# Altium schematic sheet RTL-SDR.SchDoc
size A3; SheetNumber: 2; SheetTotal: 3; SPICEModelCacheDOKHCWCC: <root> / <DocumentId>DOKHCWCC</DocumentId> / <CacheFrame Number="0"> / <Model Name="0402_782423100_10ohm" Kind="CKT"> / <Text>******* / .subckt 0402_782423100_10ohm 1 2 / Rp 1 2 14 / Cp 1 2 0.057p / Rs 1 N3 0.03 / L1 N3 2 0.0232u / .ends 0402_782423100_10ohm</Text> / </Model> / </CacheFrame> / </root>
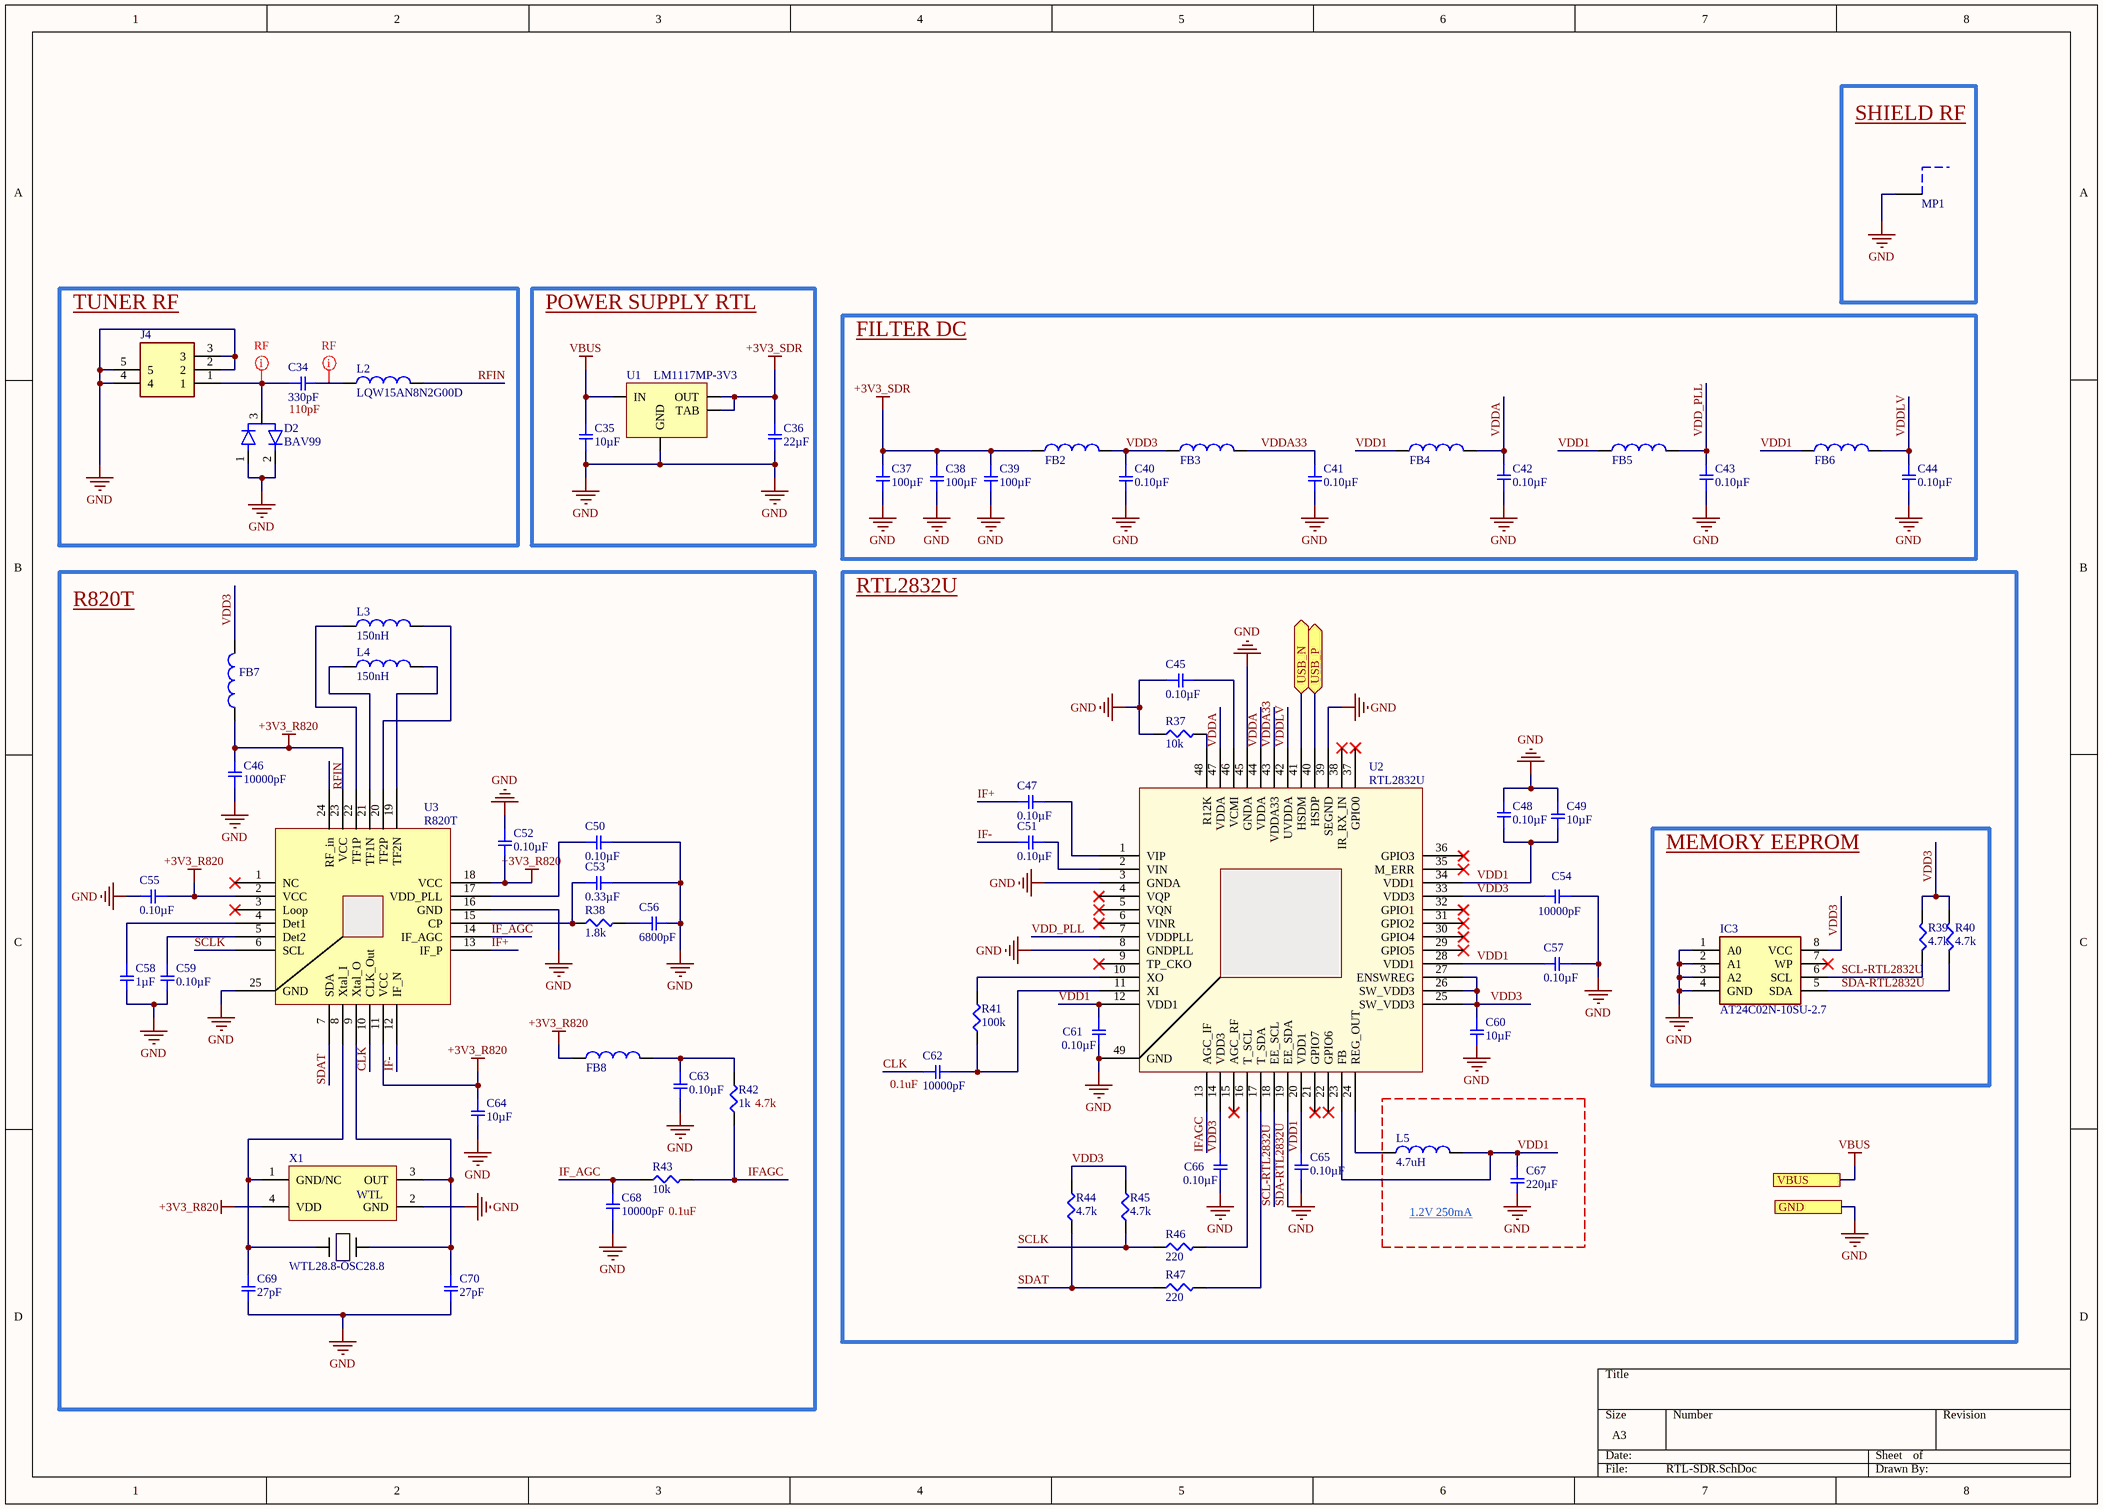
[diagram p0: RTL-SDR.SchDoc]

## Parts
C34  330pF  [SMD-0402C]
C35  10µF  [SMD-0805C]
C36  22µF  [SMD-0805C]
C37  100µF  [SMD-1210C]
C38  100µF  [SMD-1210C]
C39  100µF  [SMD-1210C]
C40  0.10µF  [SMD-0402C]
C41  0.10µF  [SMD-0402C]
C42  0.10µF  [SMD-0402C]
C43  0.10µF  [SMD-0402C]
C44  0.10µF  [SMD-0402C]
C45  0.10µF  [SMD-0402C]
C46  10000pF  [SMD-0402C]
C47  0.10µF  [SMD-0402C]
C48  0.10µF  [SMD-0402C]
C49  10µF  [SMD-0603C]
C50  0.10µF  [SMD-0402C]
C51  0.10µF  [SMD-0402C]
C52  0.10µF  [SMD-0402C]
C53  0.33µF  [SMD-0402C]
C54  10000pF  [SMD-0402C]
C55  0.10µF  [SMD-0402C]
C56  6800pF  [SMD-0402C]
C57  0.10µF  [SMD-0402C]
C58  1µF  [SMD-0402C]
C59  0.10µF  [SMD-0402C]
C60  10µF  [SMD-0603C]
C61  0.10µF  [SMD-0402C]
C62  10000pF  [SMD-0402C]
C63  0.10µF  [SMD-0402C]
C64  10µF  [SMD-0805C]
C65  0.10µF  [SMD-0402C]
C66  0.10µF  [SMD-0402C]
C67  220µF  [SMD-1210C]
C68  10000pF  [SMD-0402C]
C69  27pF  [SMD-0402C]
C70  27pF  [SMD-0402C]
D2  BAV99  [DIO_BAV99]
FB2  10Ohm  [WE-CBA_0402_L1W0.5H0.5_HC]  (value not drawn)
FB3  10Ohm  [WE-CBA_0402_L1W0.5H0.5_HC]  (value not drawn)
FB4  10Ohm  [WE-CBA_0402_L1W0.5H0.5_HC]  (value not drawn)
FB5  10Ohm  [WE-CBA_0402_L1W0.5H0.5_HC]  (value not drawn)
FB6  10Ohm  [WE-CBA_0402_L1W0.5H0.5_HC]  (value not drawn)
FB7  10Ohm  [WE-CBA_0402_L1W0.5H0.5_HC]  (value not drawn)
FB8  10Ohm  [WE-CBA_0402_L1W0.5H0.5_HC]  (value not drawn)
IC3  AT24C02N-10SU-2.7  [SOIC127P600X175-8N]
J4  SMA-J-P-H-RA-TH1  [SMAJPHRATH1]  (value not drawn)
L2  LQW15AN8N2G00D  [INDC1006X60N]
L3  150nH  [INDC1608X100N]
L4  150nH  [INDC1608X100N]
L5  4.7uH  [INDC2518X200N]
MP1  36903205S  [36903205S]  (value not drawn)
R37  10k  [SMD-0402-RES]
R38  1.8k  [SMD-0402-RES]
R39  4.7k  [SMD-0402-RES]
R40  4.7k  [SMD-0402-RES]
R41  100k  [SMD-0402-RES]
R42  1k  [SMD-0402-RES]
R43  10k  [SMD-0402-RES]
R44  4.7k  [SMD-0402-RES]
R45  4.7k  [SMD-0402-RES]
R46  220  [SMD-0402-RES]
R47  220  [SMD-0402-RES]
U1  LM1117MP-3V3  [SOT223]
U2  RTL2832U  [QFN40P600X600X84_HS-49N]
U3  R820T  [QFN50P400X400X85_HS-25N_r820t]
X1  WTL28.8-OSC28.8  [WTL28.8-OSC28.8]

## Blocks framed on the sheet
SHIELD RF: MP1
TUNER RF: C34 D2 J4 L2
POWER SUPPLY RTL: C35 C36 U1
FILTER DC: C37-C44 FB2-FB6
R820T: C46 C50 C52 C53 C55 C56 C58 C59 C63 C64 C68-C70 FB7 FB8 L3 L4 R38 R42 R43 U3 X1
RTL2832U: C45 C47-C49 C51 C54 C57 C60-C62 C65 C66 R37 R41 R44-R47 U2
MEMORY EEPROM: IC3 R39 R40
1.2V 250mA: C67 L5

## Ports
GND (see DSD_Aerobits_RPI4_OLED[1A], HUB-USB[6C]), USB_N (bidir, see DSD_Aerobits_RPI4_OLED[1A]), USB_P (bidir, see DSD_Aerobits_RPI4_OLED[1A]), VBUS (see DSD_Aerobits_RPI4_OLED[1A])

## Nets
+3V3_R820: C46.2 C52.2 C55.1 C64.1 FB7.1 FB8.1 U3.2(VCC) U3.11(VCC) U3.18(VCC) U3.23(VCC) X1.4(VDD)
+3V3_SDR: C36.2 C37.1 C38.1 C39.1 FB2.1 U1.2(OUT) U1.4(TAB)
GND: C35.1 C36.1 C37.2 C38.2 C39.2 C40.2 C41.2 C42.1 C43.1 C44.1 C45.1 C46.1 C48.2 C49.1 C50.1 C52.1 C53.1 C54.1 C55.2 C56.2 C57.1 C58.2 C59.2 C60.2 C61.2 C63.2 C64.2 C65.2 C66.2 C67.2 C68.1 C69.2 C70.2 D2.1 D2.2 IC3.1(A0) IC3.2(A1) IC3.3(A2) IC3.4(GND) J4.2 J4.3 J4.4 J4.5 MP1.1 R37.1 U1.1(GND) U2.3(GNDA) U2.8(GNDPLL) U2.39(SEGND) U2.45(GNDA) U2.49(GND) U3.16(GND) U3.25(GND) X1.2(GND) ; port GND
VBUS: C35.2 U1.3(IN) ; port VBUS
CLK: C62.1 U3.10(CLK_Out)
IF+: C47.2 U3.13(IF_P)
IF-: C51.2 U3.12(IF_N)
IF_AGC: C68.2 R43.1 U3.14(IF_AGC)
IFAGC: R42.1 R43.2 U2.13(AGC_IF)
RFIN: L2.2 U3.24(RF_in)
SCL-RTL2832U: IC3.6(SCL) R39.1 U2.18(EE_SCL)
SCLK: R45.1 R46.1 U3.6(SCL)
SDA-RTL2832U: IC3.5(SDA) R40.1 U2.19(EE_SDA)
SDAT: R44.1 R47.1 U3.7(SDA)
USB_N: U2.41(HSDM) ; port USB_N
USB_P: U2.40(HSDP) ; port USB_P
VDD1: C48.1 C49.2 C57.2 C61.1 C65.1 C67.1 FB4.1 FB5.1 FB6.1 L5.2 U2.12(VDD1) U2.20(VDD1) U2.23(FB) U2.28(VDD1) U2.34(VDD1)
VDD3: C40.1 C54.2 C60.1 C66.1 FB2.2 FB3.1 FB7.2 IC3.8(VCC) R39.2 R40.2 R44.2 R45.2 U2.14(VDD3) U2.25(SW_VDD3) U2.26(SW_VDD3) U2.27(ENSWREG) U2.33(VDD3)
VDD_PLL: C43.2 FB5.2 U2.7(VDDPLL)
VDDA: C42.2 FB4.2 U2.44(VDDA) U2.47(VDDA)
VDDA33: C41.1 FB3.2 U2.43(VDDA33)
VDDLV: C44.2 FB6.2 U2.42(UVDDA)
NetC34_1: C34.1 D2.3 J4.1
NetC34_2: C34.2 L2.1
NetC45_2: C45.2 U2.46(VCMI)
NetC47_1: C47.1 U2.1(VIP)
NetC50_2: C50.2 U3.17(VDD_PLL)
NetC51_1: C51.1 U2.2(VIN)
NetC53_2: C53.2 R38.1 U3.15(CP)
NetC56_1: C56.1 R38.2
NetC58_1: C58.1 U3.4(Det1)
NetC59_1: C59.1 U3.5(Det2)
NetC62_2: C62.2 R41.1 U2.11(XI)
NetC63_1: C63.1 FB8.2 R42.2
NetC69_1: C69.1 U3.8(Xtal_I) X1.1(GND/NC) X1.5
NetC70_1: C70.1 U3.9(Xtal_O) X1.3(OUT) X1.6
NetL3_1: L3.1 U3.22(TF1P)
NetL3_2: L3.2 U3.20(TF2P)
NetL4_1: L4.1 U3.21(TF1N)
NetL4_2: L4.2 U3.19(TF2N)
NetL5_1: L5.1 U2.24(REG_OUT)
NetR37_2: R37.2 U2.48(R12K)
NetR41_2: R41.2 U2.10(XO)
NetR46_2: R46.2 U2.16(T_SCL)
NetR47_2: R47.2 U2.17(T_SDA)

Not connected (* = marked no-connect by the designer): IC3 7(WP)*; U2 4(VQP)* 5(VQN)* 6(VINR)* 9(TP_CKO)* 15(AGC_RF)* 21(GPIO7)* 22(GPIO6)* 29(GPIO5)* 30(GPIO4)* 31(GPIO2)* 32(GPIO1)* 35(M_ERR)* 36(GPIO3)* 37(GPIO0)* 38(IR_RX_IN)*; U3 1(NC)* 3(Loop)*

## Layout directives
net class RF: NetC34_1, NetC34_2

## Notes on the sheet
- 110pF
- (near R42) 4.7k
- (near C62) 0.1uF
- (near R43) 0.1uF
- (in symbol WTL28.8-OSC28.8) WTL

## Library data of the parts
C34 = GRM1555C1E331JA01D: CAP CER 330PF 25V NP0 0402; Manufacturer: Murata Electronics North America; Factory Stock: 0; Unit Price (USD): 0,1; Minimum Quantity: 1; Tolerance: ±5%; Temperature Coefficient: C0G, NP0; Part Number: GRM1555C1E331JA01D; Datasheets: http://www.murata.com/~/media/webrenewal/support/library/catalog/products/capacitor/mlcc/c02e.pdf; Image: //media.digikey.com/Renders/Murata%20Renders/ZRB-SERIES-0402.jpg; Digi-Key Part Number: 490-8176-1-ND; Quantity Available: 41182; @ qty: 0; Packaging: Cut Tape (CT); Series: GRM; Part Status: Active; Value: 330pF; Voltage: 25V; Operating Temperature: -55°C ~ 125°C; Features: -; Ratings: -; Applications: General Purpose; Mounting Type: Surface Mount, MLCC; Package / Case: 0402 (1005 Metric); Size / Dimension: 0.039" L x 0.020" W (1.00mm x 0.50mm); Height - Seated (Max): -; Thickness (Max): 0.022" (0.55mm); Lead Spacing: -; Lead Style: -
C35 C64 = GRT21BC81C106KE01L: CAP CER 10UF 16V X6S 0805; Manufacturer: Murata Electronics North America; Factory Stock: 0; Unit Price (USD): 0,54; Minimum Quantity: 1; Tolerance: ±10%; Part Number: GRT21BC81C106KE01L; Datasheets: http://search.murata.co.jp/Ceramy/image/img/A01X/G101/ENG/GRT21BC81C106KE01-01.pdf; Image: //media.digikey.com/Renders/Murata%20Renders/GRT%20Series%200805(2012%20Metric).jpg; Digi-Key Part Number: 490-12343-1-ND; Quantity Available: 4300; @ qty: 0; Packaging: Cut Tape (CT); Series: GRT; Part Status: Active; Value: 10µF; Voltage: 16V; Temperature Coefficient: X6S; Operating Temperature: -55°C ~ 105°C; Features: Derating Recommended; Ratings: AEC-Q200; Applications: Automotive; Mounting Type: Surface Mount, MLCC; Package / Case: 0805 (2012 Metric); Size / Dimension: 0.079" L x 0.049" W (2.00mm x 1.25mm); Height - Seated (Max): -; Thickness (Max): 0.057" (1.45mm); Lead Spacing: -; Lead Style: -
C36 = GRT21BR61C226ME13L: CAP CER 22UF 16V X5R 0805; Manufacturer: Murata Electronics North America; Factory Stock: 0; Unit Price (USD): 0,58; Minimum Quantity: 1; Tolerance: ±20%; Part Number: GRT21BR61C226ME13L; Datasheets: http://search.murata.co.jp/Ceramy/image/img/A01X/G101/ENG/GRT21BR61C226ME13-01.pdf; Image: //media.digikey.com/Renders/Murata%20Renders/GRT%20Series%200805(2012%20Metric).jpg; Digi-Key Part Number: 490-12383-1-ND; Quantity Available: 32; @ qty: 0; Packaging: Cut Tape (CT); Series: GRT; Part Status: Active; Value: 22µF; Voltage: 16V; Temperature Coefficient: X5R; Operating Temperature: -55°C ~ 85°C; Features: -; Ratings: AEC-Q200; Applications: Automotive; Mounting Type: Surface Mount, MLCC; Package / Case: 0805 (2012 Metric); Size / Dimension: 0.079" L x 0.049" W (2.00mm x 1.25mm); Height - Seated (Max): -; Thickness (Max): 0.057" (1.45mm); Lead Spacing: -; Lead Style: -
C37-C39 = GRM32EC70J107ME15L: CAP CER 100UF 6.3V X7S 1210; Manufacturer: Murata Electronics North America; Factory Stock: 0; Unit Price (USD): 0,89; Minimum Quantity: 1; Tolerance: ±20%; Part Number: GRM32EC70J107ME15L; Datasheets: http://www.murata.com/~/media/webrenewal/support/library/catalog/products/capacitor/mlcc/c02e.pdf; Image: //media.digikey.com/Renders/Murata%20Renders/1210-32E.jpg; Digi-Key Part Number: 490-10530-1-ND; Quantity Available: 64; @ qty: 0; Packaging: Cut Tape (CT); Series: GRM; Part Status: Active; Value: 100µF; Voltage: 6.3V; Temperature Coefficient: X7S; Operating Temperature: -55°C ~ 125°C; Features: Derating Recommended; Ratings: -; Applications: General Purpose; Failure Rate: Surface Mount, MLCC; Mounting Type: 1210 (3225 Metric); Package / Case: 0.126" L x 0.098" W (3.20mm x 2.50mm); Size / Dimension: -; Height - Seated (Max): 0.106" (2.70mm); Thickness (Max): -; Lead Spacing: -
C40-C45 C47 C48 C50-C52 C55 C57 C59 C61 C63 C65 C66 = GCM155R71C104KA55J: CAP CER 0.1UF 16V X7R 0402; Manufacturer: Murata Electronics North America; Factory Stock: 0; Unit Price (USD): 0,1; Minimum Quantity: 1; Tolerance: ±10%; Part Number: GCM155R71C104KA55J; Datasheets: http://www.murata.com/~/media/webrenewal/support/library/catalog/products/capacitor/mlcc/c03e.ashx; Image: //media.digikey.com/Renders/Murata%20Renders/ZRB-SERIES-0402.jpg; Digi-Key Part Number: 490-7998-1-ND; Quantity Available: 618705; @ qty: 0; Packaging: Cut Tape (CT); Series: GCM; Part Status: Active; Value: 0.10µF; Voltage: 16V; Temperature Coefficient: X7R; Operating Temperature: -55°C ~ 125°C; Features: -; Ratings: AEC-Q200; Applications: Automotive; Mounting Type: Surface Mount, MLCC; Package / Case: 0402 (1005 Metric); Size / Dimension: 0.039" L x 0.020" W (1.00mm x 0.50mm); Height - Seated (Max): -; Thickness (Max): 0.022" (0.55mm); Lead Spacing: -; Lead Style: -
C46 C54 C68 = GRM155R71C103KA01J: CAP CER 10000PF 16V X7R 0402; Manufacturer: Murata Electronics North America; Factory Stock: 0; Unit Price (USD): 0,1; Minimum Quantity: 1; Tolerance: ±10%; Part Number: GRM155R71C103KA01J; Datasheets: http://www.murata.com/~/media/webrenewal/support/library/catalog/products/capacitor/mlcc/c02e.pdf; Image: //media.digikey.com/Renders/Murata%20Renders/ZRB-SERIES-0402.jpg; Digi-Key Part Number: 490-6326-1-ND; Quantity Available: 58230; @ qty: 0; Packaging: Cut Tape (CT); Series: GRM; Part Status: Active; Value: 10000pF; Voltage: 16V; Temperature Coefficient: X7R; Operating Temperature: -55°C ~ 125°C; Features: -; Ratings: -; Applications: General Purpose; Mounting Type: Surface Mount, MLCC; Package / Case: 0402 (1005 Metric); Size / Dimension: 0.039" L x 0.020" W (1.00mm x 0.50mm); Height - Seated (Max): -; Thickness (Max): 0.022" (0.55mm); Lead Spacing: -
C49 C60 = GRT188C81C106ME13D: CAP CER 10UF 16V X6S 0603; Manufacturer: Murata Electronics North America; Factory Stock: 0; Unit Price (USD): 0,46; Minimum Quantity: 1; Tolerance: ±20%; Part Number: GRT188C81C106ME13D; Datasheets: http://search.murata.co.jp/Ceramy/image/img/A01X/G101/ENG/GRT188C81C106ME13-01.pdf; Image: //media.digikey.com/Renders/Murata%20Renders/0603%28LQG18%29.jpg; Digi-Key Part Number: 490-12286-1-ND; Quantity Available: 5439; @ qty: 0; Packaging: Cut Tape (CT); Series: GRT; Part Status: Active; Value: 10µF; Voltage: 16V; Temperature Coefficient: X6S; Operating Temperature: -55°C ~ 105°C; Features: -; Ratings: AEC-Q200; Applications: Automotive; Mounting Type: Surface Mount, MLCC; Package / Case: 0603 (1608 Metric); Size / Dimension: 0.063" L x 0.031" W (1.60mm x 0.80mm); Height - Seated (Max): -; Thickness (Max): 0.035" (0.90mm); Lead Spacing: -; Lead Style: -
C53 = GRM155R61A334KE15D: CAP CER 0.33UF 10V X5R 0402; Manufacturer: Murata Electronics North America; Factory Stock: 0; Unit Price (USD): 0,17; Minimum Quantity: 1; Tolerance: ±10%; Part Number: GRM155R61A334KE15D; Datasheets: http://www.murata.com/~/media/webrenewal/support/library/catalog/products/capacitor/mlcc/c02e.pdf; Image: //media.digikey.com/Renders/Murata%20Renders/ZRB-SERIES-0402.jpg; Digi-Key Part Number: 490-3263-1-ND; Quantity Available: 378661; @ qty: 0; Packaging: Cut Tape (CT); Series: GRM; Part Status: Active; Value: 0.33µF; Voltage: 10V; Temperature Coefficient: X5R; Operating Temperature: -55°C ~ 85°C; Features: -; Ratings: -; Applications: General Purpose; Mounting Type: Surface Mount, MLCC; Package / Case: 0402 (1005 Metric); Size / Dimension: 0.039" L x 0.020" W (1.00mm x 0.50mm); Height - Seated (Max): -; Thickness (Max): 0.022" (0.55mm); Lead Spacing: -; Lead Style: -
C56 = GRM155R71E682KA01D: CAP CER 6800PF 25V X7R 0402; Manufacturer: Murata Electronics North America; Factory Stock: 0; Unit Price (USD): 0,1; Minimum Quantity: 1; Tolerance: ±10%; Part Number: GRM155R71E682KA01D; Datasheets: http://www.murata.com/~/media/webrenewal/support/library/catalog/products/capacitor/mlcc/c02e.pdf; Image: //media.digikey.com/Renders/Murata%20Renders/ZRB-SERIES-0402.jpg; Digi-Key Part Number: 490-1310-1-ND; Quantity Available: 242387; @ qty: 0; Packaging: Cut Tape (CT); Series: GRM; Part Status: Active; Value: 6800pF; Voltage: 25V; Temperature Coefficient: X7R; Operating Temperature: -55°C ~ 125°C; Features: -; Ratings: -; Applications: General Purpose; Mounting Type: Surface Mount, MLCC; Package / Case: 0402 (1005 Metric); Size / Dimension: 0.039" L x 0.020" W (1.00mm x 0.50mm); Height - Seated (Max): -; Thickness (Max): 0.022" (0.55mm); Lead Spacing: -; Lead Style: -
C58 = GRM155R61E105MA12D: CAP CER 1UF 25V X5R 0402; Manufacturer: Murata Electronics North America; Factory Stock: 0; Unit Price (USD): 0,1; Minimum Quantity: 1; Tolerance: ±20%; Part Number: GRM155R61E105MA12D; Datasheets: http://www.murata.com/~/media/webrenewal/support/library/catalog/products/capacitor/mlcc/c02e.pdf; Image: //media.digikey.com/Renders/Murata%20Renders/ZRB-SERIES-0402.jpg; Digi-Key Part Number: 490-10018-1-ND; Quantity Available: 32609; @ qty: 0; Packaging: Cut Tape (CT); Series: GRM; Part Status: Active; Value: 1µF; Voltage: 25V; Temperature Coefficient: X5R; Operating Temperature: -55°C ~ 85°C; Features: Derating Recommended; Ratings: -; Applications: General Purpose; Mounting Type: Surface Mount, MLCC; Package / Case: 0402 (1005 Metric); Size / Dimension: 0.039" L x 0.020" W (1.00mm x 0.50mm); Height - Seated (Max): -; Thickness (Max): 0.022" (0.55mm); Lead Spacing: -; Lead Style: -
C62 = GRM155R71C103KA01D: CAP CER 10000PF 16V X7R 0402; Manufacturer: Murata Electronics North America; Factory Stock: 0; Unit Price (USD): 0,1; Minimum Quantity: 1; Tolerance: ±10%; Part Number: GRM155R71C103KA01D; Datasheets: http://www.murata.com/~/media/webrenewal/support/library/catalog/products/capacitor/mlcc/c02e.pdf; Image: //media.digikey.com/Renders/Murata%20Renders/ZRB-SERIES-0402.jpg; Digi-Key Part Number: 490-1313-1-ND; Quantity Available: 3056688; @ qty: 0; Packaging: Cut Tape (CT); Series: GRM; Part Status: Active; Value: 10000pF; Voltage: 16V; Temperature Coefficient: X7R; Operating Temperature: -55°C ~ 125°C; Features: -; Ratings: -; Applications: General Purpose; Mounting Type: Surface Mount, MLCC; Package / Case: 0402 (1005 Metric); Size / Dimension: 0.039" L x 0.020" W (1.00mm x 0.50mm); Height - Seated (Max): -; Thickness (Max): 0.022" (0.55mm); Lead Spacing: -; Lead Style: -
C67 = GRM32EC80G227ME05L: CAP CER 220UF 4V X6S 1210; Manufacturer: Murata Electronics North America; Factory Stock: 0; Unit Price (USD): 1,76; Minimum Quantity: 1; Tolerance: ±20%; Part Number: GRM32EC80G227ME05L; Datasheets: http://search.murata.co.jp/Ceramy/image/img/A01X/G101/ENG/GRM32EC80G227ME05-01.pdf; Image: //media.digikey.com/Renders/Murata%20Renders/1210-32E.jpg; Digi-Key Part Number: 490-13973-1-ND; Quantity Available: 2940; @ qty: 0; Packaging: Cut Tape (CT); Series: GRM; Part Status: Active; Value: 220µF; Voltage: 4V; Temperature Coefficient: X6S; Operating Temperature: -55°C ~ 105°C; Features: -; Ratings: -; Applications: General Purpose; Failure Rate: Surface Mount, MLCC; Mounting Type: 1210 (3225 Metric); Package / Case: 0.126" L x 0.098" W (3.20mm x 2.50mm); Size / Dimension: -; Height - Seated (Max): 0.110" (2.80mm); Thickness (Max): -; Lead Spacing: -
C69 C70 = GRM1555C1E270JA01D: CAP CER 27PF 25V NP0 0402; Manufacturer: Murata Electronics North America; Factory Stock: 0; Unit Price (USD): 0,1; Minimum Quantity: 1; Tolerance: ±5%; Temperature Coefficient: C0G, NP0; Part Number: GRM1555C1E270JA01D; Datasheets: http://www.murata.com/~/media/webrenewal/support/library/catalog/products/capacitor/mlcc/c02e.pdf; Image: //media.digikey.com/Renders/Murata%20Renders/ZRB-SERIES-0402.jpg; Digi-Key Part Number: 490-6176-1-ND; Quantity Available: 76036; @ qty: 0; Packaging: Cut Tape (CT); Series: GRM; Part Status: Active; Value: 27pF; Voltage: 25V; Operating Temperature: -55°C ~ 125°C; Features: -; Ratings: -; Applications: General Purpose; Mounting Type: Surface Mount, MLCC; Package / Case: 0402 (1005 Metric); Size / Dimension: 0.039" L x 0.020" W (1.00mm x 0.50mm); Height - Seated (Max): -; Thickness (Max): 0.022" (0.55mm); Lead Spacing: -; Lead Style: -
D2 = BAV99: Diode Array 1 Pair Series Connection Standard 100V 215mA (DC) Surface Mount TO-236-3, SC-59, SOT-23-3; MF: ON Semiconductor; Price: None; Availability: In Stock; MP: BAV99; Package: SOT-23-3 Motorola; SnapEDA_Link: https://www.snapeda.com/parts/BAV99/Onsemi/view-part/?ref=snap; Check_prices: https://www.snapeda.com/parts/BAV99/Onsemi/view-part/?ref=eda; Value: *; Purchase-URL: https://pricing.snapeda.com/search/part/BAV99/?ref=eda
FB2-FB8 = 782423100: WE-CBA SMT EMI Suppression Ferrite Bead, size 0402, 10Ohm, 1.5A; Manufacturer: Wurth Elektronik; Case/Size Code: 0402; DC Resistance Max: 0.03Ohm; Impedance Max: 17Ohm; Type: High Current; Manufacturer Part Number: 782423100; Category: Ferrites for PCB Assembly; Match Code: WE-CBA; ComponentLink1Description: Website Link; ComponentLink1URL: https://www.we-online.com/redexpert/article/782423100?ad; ComponentLink2Description: Datasheet Link; ComponentLink2URL: https://www.we-online.com/redexpert/spec/782423100?ad; Mount: Surface Mount; Operating Temperature Max: 125°C; Operating Temperature Min: -55°C; Packaging: Tape and Reel; Length: 1mm; Width: 0.5mm; Height: 0.5mm; Automotive: Yes; Impedance @100MHz: 10Ohm; Rated Current: 1.5A
IC3 = AT24C02N-10SU-2.7: Integrated Circuit; Manufacturer_Name: Microchip; Datasheet Link: https://www.mouser.com/datasheet/2/268/atmel_doc0180-1180509.pdf; Height: 1.75mm; Manufacturer_Part_Number: AT24C02N-10SU-2.7; Mouser Part Number: N/A; Mouser Price/Stock: https://www.mouser.com/Search/Refine.aspx?Keyword=N%2FA
J4 = SMA-J-P-H-RA-TH1: Connector; Manufacturer_Name: SAMTEC; Datasheet Link: http://suddendocs.samtec.com/prints/sma-j-p-x-ra-th1-mkt.pdf; Height: 9.86mm; Manufacturer_Part_Number: SMA-J-P-H-RA-TH1; Mouser Part Number: 200-SMAJPHRATH1; Mouser Price/Stock: https://www.mouser.co.uk/ProductDetail/Samtec/SMA-J-P-H-RA-TH1?qs=IAPfasySNH9bBmPI%2F132gw%3D%3D; Arrow Part Number: SMA-J-P-H-RA-TH1; Arrow Price/Stock: https://www.arrow.com/en/products/sma-j-p-h-ra-th1/samtec?region=europe
L2 = LQW15AN8N2G00D: LQW15A 0,0082ÂµH 540mA 2% WWT; Package: None; Price: None; Value: *; MP: LQW15AN8N2G00D; Availability: Unavailable
L3 L4 = LQW18ANR15J00D: CHIP COIL LQW18A; Package: None; Price: None; Value: *; MP: LQW18ANR15J00D; Availability: Unavailable
L5 = CB2518T4R7M: Ind Power Chip Wirewound 4.7uH 20% 7.96MHz Ferrite 1.1A 1007 T/R; Price: None; MP: CB2518T4R7M; Value: *; Availability: Unavailable; Package: None
MP1 = 36903205S: WE-SHC Shielding Cabinet, One Piece, Tin Plated, Tape and Reel, 20x20x3mm; Manufacturer: Wurth Elektronik; ComponentLink1Description: Website Link; ComponentLink1URL: https://www.we-online.com/redexpert/article/36903205S?ad; ComponentLink2Description: Datasheet Link; ComponentLink2URL: https://www.we-online.com/redexpert/spec/36903205S?ad; Manufacturer Part Number: 36903205S; Category: EMC Shielding; Match Code: WE-SHC; Mount: Surface Mount; Operating Temperature Max: 125°C; Operating Temperature Min: -40°C; Packaging: Tape and Reel; Length: 20mm; Width: 20mm; Height: 3mm; Base Material: Tin plate; Plating: Tin Plated; Type: One Piece
R37 R43 = ERJ-2RKF1002X: RES SMD 10K OHM 1% 1/10W 0402; Manufacturer: Panasonic Electronic Components; Factory Stock: 0; Unit Price (USD): 0.00496; @ qty: 1500; Minimum Quantity: 1; Power (Watts): 0.1W, 1/10W; Temperature Coefficient: ±100ppm/°C; Part Number: ERJ-2RKF1002X; Datasheets: http://industrial.panasonic.com/www-cgi/jvcr13pz.cgi?E+PZ+3+AOA0002+ERJ2RKF1002X+7+WW; Image: //media.digikey.com/Photos/Panasonic%20Photos/ERJ-PA2-Series.jpg; Digi-Key Part Number: P10.0KLCT-ND; Quantity Available: 9922786; Packaging: Cut Tape (CT); Series: ERJ; Part Status: Active; Value: 10k; Tolerance: ±1%; Composition: Thick Film; Features: Automotive AEC-Q200; Operating Temperature: -55°C ~ 155°C; Package / Case: 0402 (1005 Metric); Supplier Device Package: 0402; Size / Dimension: 0.039" L x 0.020" W (1.00mm x 0.50mm); Height - Seated (Max): 0.016" (0.40mm); Number of Terminations: 2; Failure Rate: -
R38 = ERJ-2GEJ182X: RES SMD 1.8K OHM 5% 1/10W 0402; Manufacturer: Panasonic Electronic Components; Factory Stock: 0; Unit Price (USD): 0.00350; @ qty: 1500; Minimum Quantity: 1; Power (Watts): 0.1W, 1/10W; Temperature Coefficient: ±200ppm/°C; Part Number: ERJ-2GEJ182X; Datasheets: http://industrial.panasonic.com/www-cgi/jvcr13pz.cgi?E+PZ+3+AOA0001+ERJ2GEJ182X+7+WW; Image: //media.digikey.com/Photos/Panasonic%20Photos/ERJ-PA2-Series.jpg; Digi-Key Part Number: P1.8KJCT-ND; Quantity Available: 170712; Packaging: Cut Tape (CT); Series: ERJ; Part Status: Active; Value: 1.8k; Tolerance: ±5%; Composition: Thick Film; Features: Automotive AEC-Q200; Operating Temperature: -55°C ~ 155°C; Package / Case: 0402 (1005 Metric); Supplier Device Package: 0402; Size / Dimension: 0.039" L x 0.020" W (1.00mm x 0.50mm); Height - Seated (Max): 0.016" (0.40mm); Number of Terminations: 2; Failure Rate: -
R39 R40 R44 R45 = ERJ-2RKF4701X: RES SMD 4.7K OHM 1% 1/10W 0402; Manufacturer: Panasonic Electronic Components; Factory Stock: 0; Unit Price (USD): 0.00496; @ qty: 1500; Minimum Quantity: 1; Power (Watts): 0.1W, 1/10W; Temperature Coefficient: ±100ppm/°C; Part Number: ERJ-2RKF4701X; Datasheets: http://industrial.panasonic.com/www-cgi/jvcr13pz.cgi?E+PZ+3+AOA0002+ERJ2RKF4701X+7+WW; Image: //media.digikey.com/Photos/Panasonic%20Photos/ERJ-PA2-Series.jpg; Digi-Key Part Number: P4.70KLCT-ND; Quantity Available: 1881807; Packaging: Cut Tape (CT); Series: ERJ; Part Status: Active; Value: 4.7k; Tolerance: ±1%; Composition: Thick Film; Features: Automotive AEC-Q200; Operating Temperature: -55°C ~ 155°C; Package / Case: 0402 (1005 Metric); Supplier Device Package: 0402; Size / Dimension: 0.039" L x 0.020" W (1.00mm x 0.50mm); Height - Seated (Max): 0.016" (0.40mm); Number of Terminations: 2; Failure Rate: -
R41 = ERJ-2RKF1003X: RES SMD 100K OHM 1% 1/10W 0402; Manufacturer: Panasonic Electronic Components; Factory Stock: 0; Unit Price (USD): 0.00496; @ qty: 1500; Minimum Quantity: 1; Power (Watts): 0.1W, 1/10W; Temperature Coefficient: ±100ppm/°C; Part Number: ERJ-2RKF1003X; Datasheets: http://industrial.panasonic.com/www-cgi/jvcr13pz.cgi?E+PZ+3+AOA0002+ERJ2RKF1003X+7+WW; Image: //media.digikey.com/Photos/Panasonic%20Photos/ERJ-PA2-Series.jpg; Digi-Key Part Number: P100KLCT-ND; Quantity Available: 2645965; Packaging: Cut Tape (CT); Series: ERJ; Part Status: Active; Value: 100k; Tolerance: ±1%; Composition: Thick Film; Features: Automotive AEC-Q200; Operating Temperature: -55°C ~ 155°C; Package / Case: 0402 (1005 Metric); Supplier Device Package: 0402; Size / Dimension: 0.039" L x 0.020" W (1.00mm x 0.50mm); Height - Seated (Max): 0.016" (0.40mm); Number of Terminations: 2; Failure Rate: -
R42 = ERJ-2GEJ102X: RES SMD 1K OHM 5% 1/10W 0402; Manufacturer: Panasonic Electronic Components; Factory Stock: 0; Unit Price (USD): 0.00350; @ qty: 1500; Minimum Quantity: 1; Power (Watts): 0.1W, 1/10W; Temperature Coefficient: ±200ppm/°C; Part Number: ERJ-2GEJ102X; Datasheets: http://industrial.panasonic.com/www-cgi/jvcr13pz.cgi?E+PZ+3+AOA0001+ERJ2GEJ102X+7+WW; Image: //media.digikey.com/Photos/Panasonic%20Photos/ERJ-PA2-Series.jpg; Digi-Key Part Number: P1.0KJCT-ND; Quantity Available: 1939857; Packaging: Cut Tape (CT); Series: ERJ; Part Status: Active; Value: 1k; Tolerance: ±5%; Composition: Thick Film; Features: Automotive AEC-Q200; Operating Temperature: -55°C ~ 155°C; Package / Case: 0402 (1005 Metric); Supplier Device Package: 0402; Size / Dimension: 0.039" L x 0.020" W (1.00mm x 0.50mm); Height - Seated (Max): 0.016" (0.40mm); Number of Terminations: 2; Failure Rate: -
R46 R47 = ERJ-PA2J221X: RES SMD 220 OHM 5% 1/5W 0402; Manufacturer: Panasonic Electronic Components; Factory Stock: 0; Unit Price (USD): 0.02020; @ qty: 1500; Minimum Quantity: 1; Power (Watts): 0.2W, 1/5W; Temperature Coefficient: ±200ppm/°C; Part Number: ERJ-PA2J221X; Datasheets: https://industrial.panasonic.com/cdbs/www-data/pdf/RDA0000/AOA0000C243.pdf; Image: //media.digikey.com/Photos/Panasonic%20Photos/ERJ-PA2-Series.jpg; Digi-Key Part Number: P17189CT-ND; Quantity Available: 8785; Packaging: Cut Tape (CT); Series: ERJ; Part Status: Active; Value: 220; Tolerance: ±5%; Composition: Thick Film; Features: Automotive AEC-Q200, Pulse Withstanding; Operating Temperature: -55°C ~ 155°C; Package / Case: 0402 (1005 Metric); Supplier Device Package: 0402; Size / Dimension: 0.039" L x 0.020" W (1.00mm x 0.50mm); Height - Seated (Max): 0.016" (0.40mm); Number of Terminations: 2; Failure Rate: -
U1 = LM1117MP-3V3: 800mA Low-Dropout Linear Regulator; PartNumber: LM1117MP-3.3; Manufacturer: National Semiconductor; CompType: LDO IC; PackageTopMarking: XYTT*N05A; PowerWise: N; Published: 4-Dec-2008; DatasheetVersion: Apr-2006; PackageVersion: revB, Apr-2003; PackageReference: MP04A; Publisher: Altium Limited; PackageDescription: Molded SOT-223, 6.50 x 3.56 x 1.6mm Body, 4 Lead, 2.3mm Pitch; RoHS: O; PinCount: 4; DigiKeyPartNumber: LM1117MP-3.3CT-ND; Code_JEDEC: TO-261-AA; Code_IPC: SOT223-4; ComponentLink1Description: LM1117 Datasheet; ComponentLink1URL: http://www.national.com/ds/LM/LM1117.pdf; ComponentLink2Description: LM1117 Web Page; ComponentLink2URL: http://www.national.com/pf/LM/LM1117.html; ComponentLink3Description: MP04A Package Page; ComponentLink3URL: http://www.national.com/packaging/folders/mp04a.html
U2 = RTL2832U: RTL2832U DVB-T COFDM Demodulator + USB 2.0; Manufacturer: Realtek; Publisher: ftg; ComponentLink1Description: Work on RTL2832U Datasheet; ComponentLink1URL: https://sites.google.com/site/oh2ftg/home/rtl2832u; Mounting: Surface Mount; Package: QFN48